# EAGLE schematic fpga-breakout (EAGLE 9.5.2)

## Sheet 1 of 3
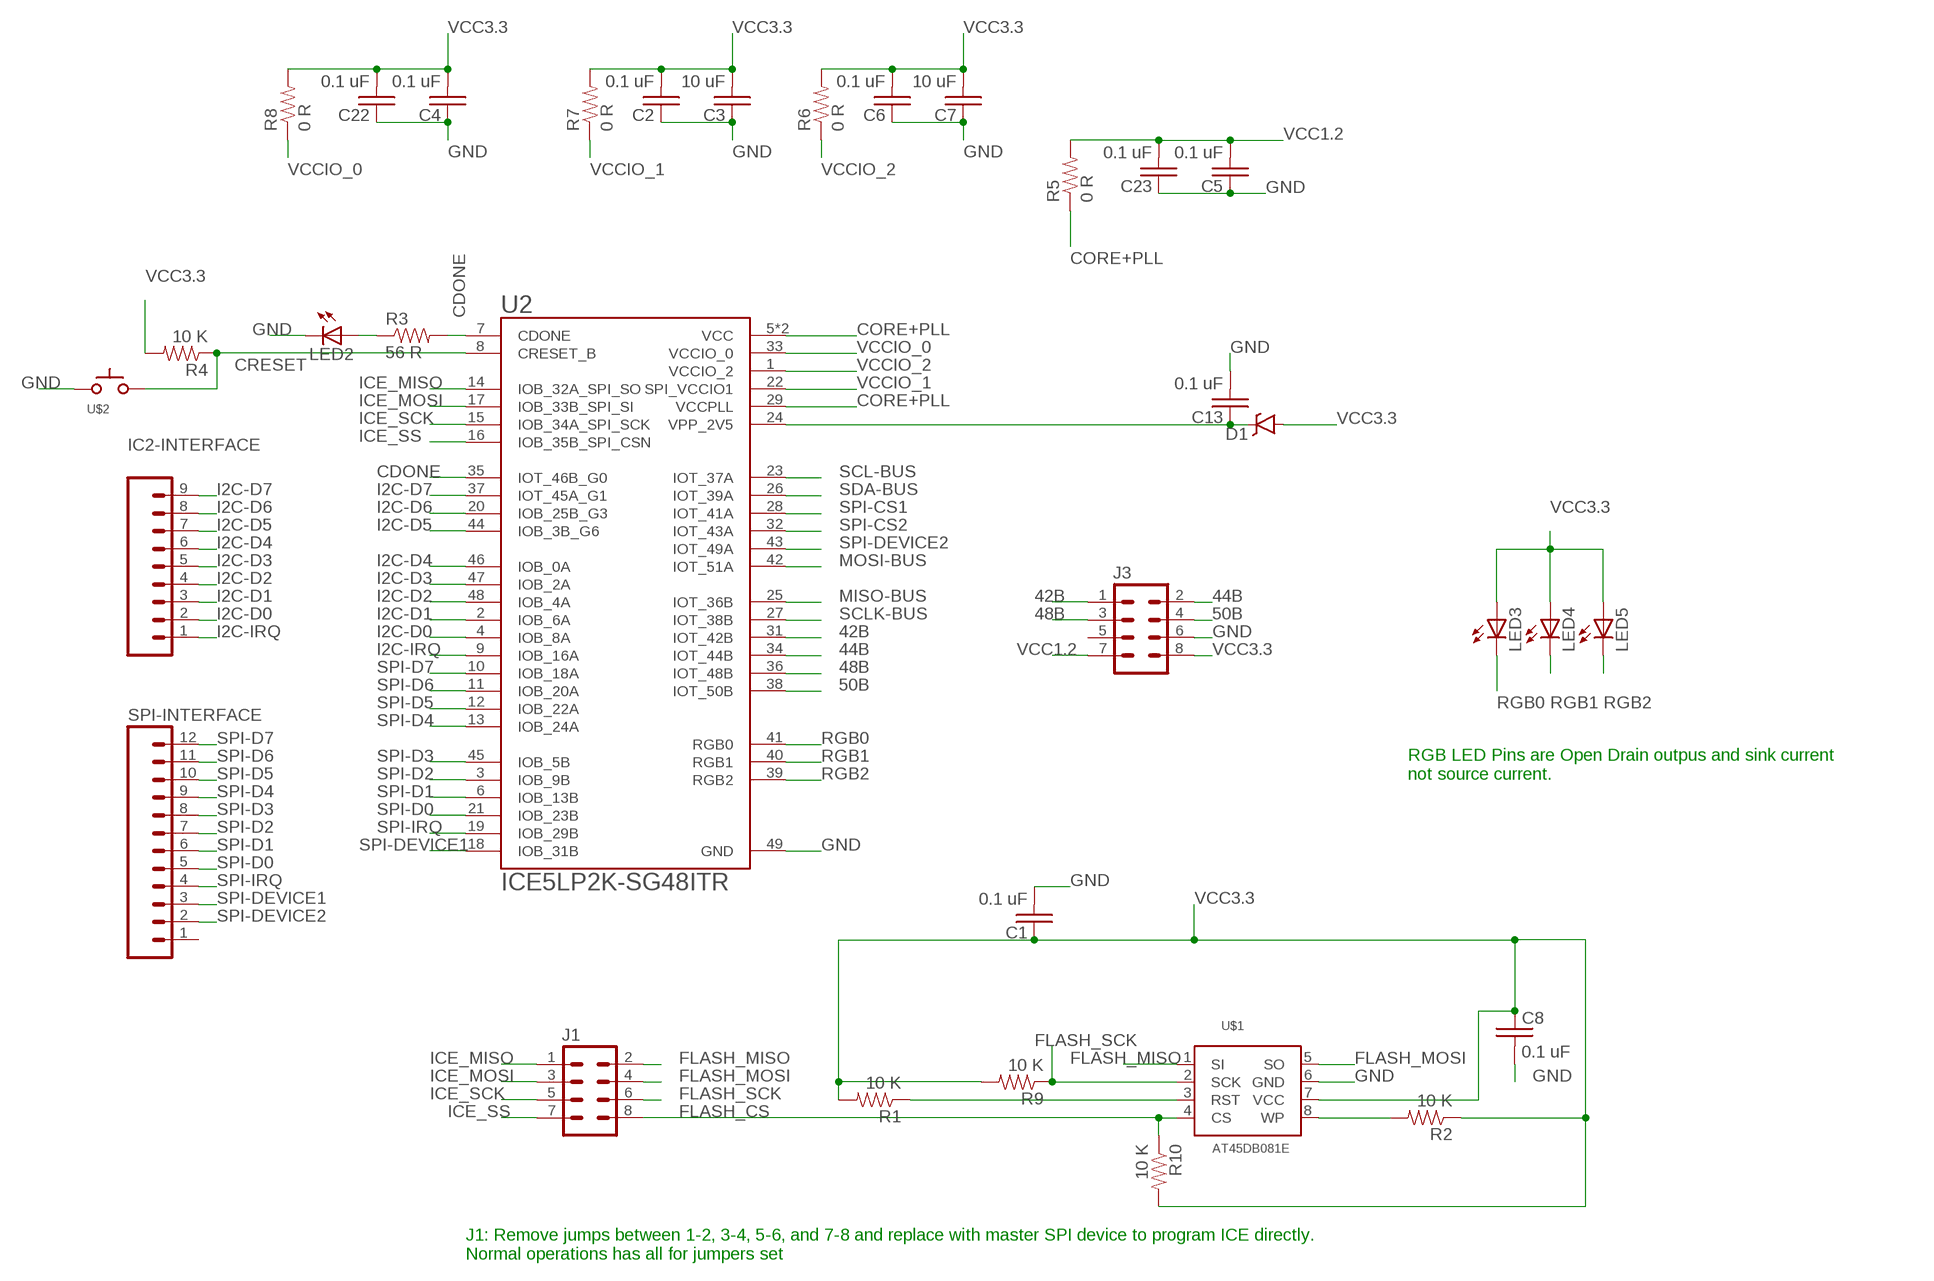
[diagram p0: schematic, sheet 1]

### Parts
C1  0.1 uF  C-USC0603  [C0603]
C2  0.1 uF  C-USC0603  [C0603]
C3  10 uF  C-USC0603  [C0603]
C4  0.1 uF  C-USC0603  [C0603]
C5  0.1 uF  C-USC0603  [C0603]
C6  0.1 uF  C-USC0603  [C0603]
C7  10 uF  C-USC0603  [C0603]
C8  0.1 uF  C-USC0603  [C0603]
C13  0.1 uF  C-USC0603  [C0603]
C22  0.1 uF  C-USC0603  [C0603]
C23  0.1 uF  C-USC0603  [C0603]
D1  DIODE-SCHOTTKYDIOAD-TH  [DIOAD1060W80L520D270]
IC2-INTERFACE  M09  [1X09]
J1  M04X2  [2X4]
J3  M04X2  [2X4]
LED2  LED1206  [LED-1206]
LED3  LED3MM  [LED3MM]
LED4  LED3MM  [LED3MM]
LED5  LED3MM  [LED3MM]
R1  10 K  RESISTOR0805-RES  [0805]
R2  10 K  RESISTOR0805-RES  [0805]
R3  56 R  RESISTOR1206  [1206]
R4  10 K  RESISTOR0805-RES  [0805]
R5  0 R  RESISTOR0805-RES  [0805]
R6  0 R  RESISTOR0805-RES  [0805]
R7  0 R  RESISTOR0805-RES  [0805]
R8  0 R  RESISTOR0805-RES  [0805]
R9  10 K  RESISTOR0805-RES  [0805]
R10  10 K  RESISTOR0805-RES  [0805]
SPI-INTERFACE  M12PTH  [1X12]
U2  ICE5LP2K-SG48ITR  [QFN50P700X700X100-49N]
U$1  AT45DB8081E  [SOIC127P600X175-8N]
U$2  SWITCH_TACTILETACTILE-2PIN-NARROW  [TACTILE-2PIN-NARROW]

### Nets
42B: J3.1 U2.31(IOT_42B)
44B: J3.2 U2.34(IOT_44B)
48B: J3.3 U2.36(IOT_48B)
50B: J3.4 U2.38(IOT_50B)
CDONE: R3.2 U2.7(CDONE) U2.35(IOT_46B_G0)
CORE+PLL: R5.1 U2.5(VCC) U2.29(VCCPLL) U2.30(VCC)
CRESET: R4.1 U2.8(CRESET_B) U$2.P$1(A)
FLASH_CS: J1.8 R10.1 U$1.4(CS)
FLASH_MISO: J1.2 U$1.1(SI)
FLASH_MOSI: J1.4 U$1.5(SO)
FLASH_SCK: J1.6 R9.1 U$1.2(SCK)
GND: C1.2 C2.1 C3.1 C4.1 C5.1 C6.1 C7.1 C8.2 C13.2 C22.1 C23.1 J3.6 LED2.C U2.49(GND) U$1.6(GND) U$2.P$2(C) ; also sheet 2,3
I2C-D0: IC2-INTERFACE.2 U2.4(IOB_8A)
I2C-D1: IC2-INTERFACE.3 U2.2(IOB_6A)
I2C-D2: IC2-INTERFACE.4 U2.48(IOB_4A)
I2C-D3: IC2-INTERFACE.5 U2.47(IOB_2A)
I2C-D4: IC2-INTERFACE.6 U2.46(IOB_0A)
I2C-D5: IC2-INTERFACE.7 U2.44(IOB_3B_G6)
I2C-D6: IC2-INTERFACE.8 U2.20(IOB_25B_G3)
I2C-D7: IC2-INTERFACE.9 U2.37(IOT_45A_G1)
I2C-IRQ: IC2-INTERFACE.1 U2.9(IOB_16A)
ICE_MISO: J1.1 U2.14(IOB_32A_SPI_SO)
ICE_MOSI: J1.3 U2.17(IOB_33B_SPI_SI)
ICE_SCK: J1.5 U2.15(IOB_34A_SPI_SCK)
ICE_SS: J1.7 U2.16(IOB_35B_SPI_CSN)
MISO-BUS: U2.25(IOT_36B) ; also sheet 3
MOSI-BUS: U2.42(IOT_51A) ; also sheet 3
N$1: LED2.A R3.1
N$4: R1.1 U$1.3(RST)
N$5: C13.1 D1.C U2.24(VPP_2V5)
N$7: R2.2 U$1.8(WP)
RGB0: LED3.K(C) U2.41(RGB0)
RGB1: LED4.K(C) U2.40(RGB1)
RGB2: LED5.K(C) U2.39(RGB2)
SCL-BUS: U2.23(IOT_37A) ; also sheet 3
SCLK-BUS: U2.27(IOT_38B) ; also sheet 3
SDA-BUS: U2.26(IOT_39A) ; also sheet 3
SPI-CS1: U2.28(IOT_41A) ; also sheet 3
SPI-CS2: U2.32(IOT_43A) ; also sheet 3
SPI-D0: SPI-INTERFACE.5 U2.21(IOB_23B)
SPI-D1: SPI-INTERFACE.6 U2.6(IOB_13B)
SPI-D2: SPI-INTERFACE.7 U2.3(IOB_9B)
SPI-D3: SPI-INTERFACE.8 U2.45(IOB_5B)
SPI-D4: SPI-INTERFACE.9 U2.13(IOB_24A)
SPI-D5: SPI-INTERFACE.10 U2.12(IOB_22A)
SPI-D6: SPI-INTERFACE.11 U2.11(IOB_20A)
SPI-D7: SPI-INTERFACE.12 U2.10(IOB_18A)
SPI-DEVICE1: SPI-INTERFACE.3 U2.18(IOB_31B)
SPI-DEVICE2: SPI-INTERFACE.2 U2.43(IOT_49A)
SPI-IRQ: SPI-INTERFACE.4 U2.19(IOB_29B)
VCC1.2: C5.2 C23.2 J3.7 R5.2 ; also sheet 2
VCC3.3: C1.1 C2.2 C3.2 C4.2 C6.2 C7.2 C8.1 C22.2 D1.A J3.8 LED3.A LED4.A LED5.A R1.2 R2.1 R4.2 R6.2 R7.2 R8.2 R9.2 R10.2 U$1.7(VCC) ; also sheet 2,3
VCCIO_0: R8.1 U2.33(VCCIO_0)
VCCIO_1: R7.1 U2.22(SPI_VCCIO1)
VCCIO_2: R6.1 U2.1(VCCIO_2)
Unconnected: J3.5 SPI-INTERFACE.1

### Notes on the sheet
- RGB LED Pins are Open Drain outpus and sink current 
  not source current.
- J1: Remove jumps between 1-2, 3-4, 5-6, and 7-8 and replace with master SPI device to program ICE directly.
  Normal operations has all for jumpers set

## Sheet 2 of 3
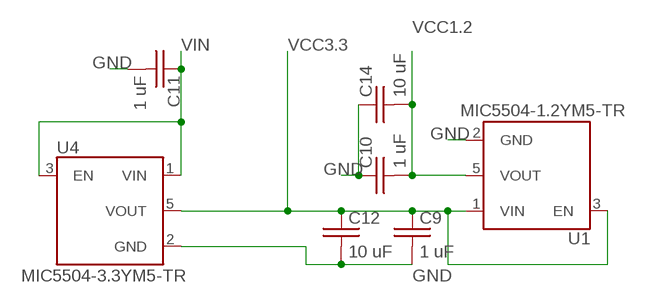
[diagram p1: schematic, sheet 2]

### Parts
C9  1 uF  C-USC0603  [C0603]
C10  1 uF  C-USC0603  [C0603]
C11  1 uF  C-USC0603  [C0603]
C12  10 uF  C-USC0603  [C0603]
C14  10 uF  C-USC0603  [C0603]
U1  MIC5504-1.2YM5-TR  [SOT23-5P95_280X145XL45X37N]
U4  MIC5504-3.3YM5-TR  [SOT23-5P95_280X145XL45X37N]

### Nets
GND: C9.2 C10.1 C11.2 C12.2 C14.1 U1.2(GND) U4.2(GND) ; also sheet 1,3
VCC1.2: C10.2 C14.2 U1.5(VOUT) ; also sheet 1
VCC3.3: C9.1 C12.1 U1.1(VIN) U1.3(EN) U4.5(VOUT) ; also sheet 1,3
VIN: C11.1 U4.1(VIN) U4.3(EN)

## Sheet 3 of 3
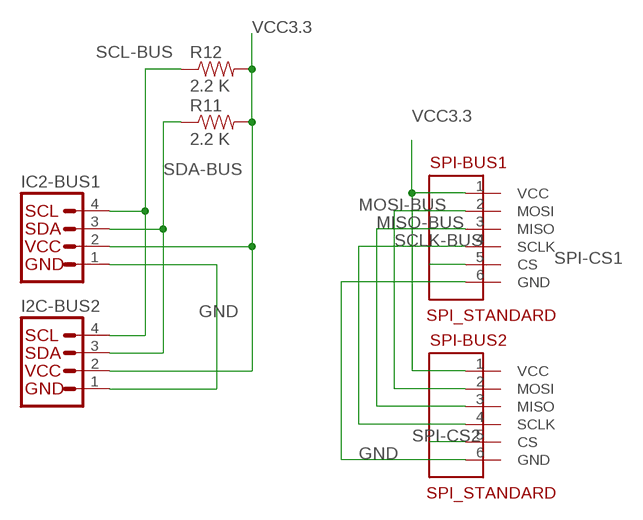
[diagram p2: schematic, sheet 3]

### Parts
I2C-BUS2  I2C_STANDARD  [1X04]
IC2-BUS1  I2C_STANDARD  [1X04]
R11  2.2 K  RESISTOR0805-RES  [0805]
R12  2.2 K  RESISTOR0805-RES  [0805]
SPI-BUS1  SPI_STANDARD  [1X06]
SPI-BUS2  SPI_STANDARD  [1X06]

### Nets
GND: I2C-BUS2.1 IC2-BUS1.1 SPI-BUS1.6(GND) SPI-BUS2.6(GND) ; also sheet 1,2
MISO-BUS: SPI-BUS1.3(MISO) SPI-BUS2.3(MISO) ; also sheet 1
MOSI-BUS: SPI-BUS1.2(MOSI) SPI-BUS2.2(MOSI) ; also sheet 1
SCL-BUS: I2C-BUS2.4 IC2-BUS1.4 R12.1 ; also sheet 1
SCLK-BUS: SPI-BUS1.4(SCLK) SPI-BUS2.4(SCLK) ; also sheet 1
SDA-BUS: I2C-BUS2.3 IC2-BUS1.3 R11.1 ; also sheet 1
SPI-CS1: SPI-BUS1.5(CS) ; also sheet 1
SPI-CS2: SPI-BUS2.5(CS) ; also sheet 1
VCC3.3: I2C-BUS2.2 IC2-BUS1.2 R11.2 R12.2 SPI-BUS1.1(VCC) SPI-BUS2.1(VCC) ; also sheet 1,2

## Library data of the parts
C1-C14 C22 C23 = passives:C-US: CAPACITOR, American symbol
D1 = passives:DIODE-SCHOTTKY
I2C-BUS2 IC2-BUS1 = connector:I2C_STANDARD: SparkFun has standardized on a pinout for all I2C based sensor breakouts. This pinout allows I2C boards to be plugged directly into the headers on Arduino Uno compatible boards, and to be daisy chained easily.
IC2-INTERFACE = connector:M09: Header 9 Standard 9-pin 0.1" header. Use with straight break away headers (SKU : PRT-00116), right angle break away headers (PRT-00553), swiss pins (PRT-00743), machine pins (PRT-00117), and female headers (PRT-00115).
J1 J3 = connector:M04X2: .1" header, two rows of four.
LED2-LED5 = leds:LED: LEDs Standard schematic elements and footprints for 5mm, 3mm, 1206, and 0603 sized LEDs. 5mm - Spark Fun Electronics SKU : COM-00529 (and others)
R1-R12 = passives:RESISTOR: Resistor Basic schematic elements and footprints for 0603, 1206, and PTH resistors.
SPI-BUS1 SPI-BUS2 = connector:SPI_STANDARD: Standard SPI
SPI-INTERFACE = connector:M12: Header 12 Standard 12-pin 0.1" header. Use with straight break away headers (SKU : PRT-00116), right angle break away headers (PRT-00553), swiss pins (PRT-00743), machine pins (PRT-00117), and female headers (PRT-00115).
U1 = voltage-regulator:MIC5504-1.2YM5-TR: Single 300mA LDO with Enable Pull-Down & Auto Discharge, 5 SOT-23 T/R; AVAILABILITY: Unavailable; DESCRIPTION: Single 300mA LDO with Enable Pull-Down & Auto Discharge, 5 SOT-23 T/R; MF: Microchip; MP: MIC5504-1.2YM5-TR; PACKAGE: SOT-23 Microchip; PRICE: None
U2 = FPGA:ICE5LP2K-SG48ITR: Ic Fpga 1100luts 1.2v 48qfn; DESCRIPTION: 1100logic cells 48 pin QFN industrial temp reels; DIGI-KEY_PART_NUMBER: 220-2155-1-ND; DIGI-KEY_PURCHASE_URL: https://www.digikey.com/product-detail/en/lattice-semiconductor-corporation/ICE5LP1K-SG48ITR/220-2155-1-ND/8255949?utm_source=snapeda&utm_medium=aggregator&utm_campaign=symbol; MF: Lattice Semiconductor; MP: ICE5LP1K-SG48ITR; PACKAGE: QFN-48 Lattice Semiconductor
U4 = voltage-regulator:MIC5504-3.3YM5-TR: Single 300mA LDO with Enable Pull-Down & Auto Discharge, 5 SOT-23 T/R; AVAILABILITY: Unavailable; DESCRIPTION: Single 300mA LDO with Enable Pull-Down & Auto Discharge, 5 SOT-23 T/R; MF: Microchip; MP: MIC5504-1.2YM5-TR; PACKAGE: SOT-23 Microchip; PRICE: None
U$1 = memories:AT45DB8081E
U$2 = switches:SWITCH_TACTILE

## Net classes
2 5v: width 0.254 mm, drill 0.8 mm, clearance 0.178 mm